# EAGLE design programming_board (EAGLE 6.5.0)
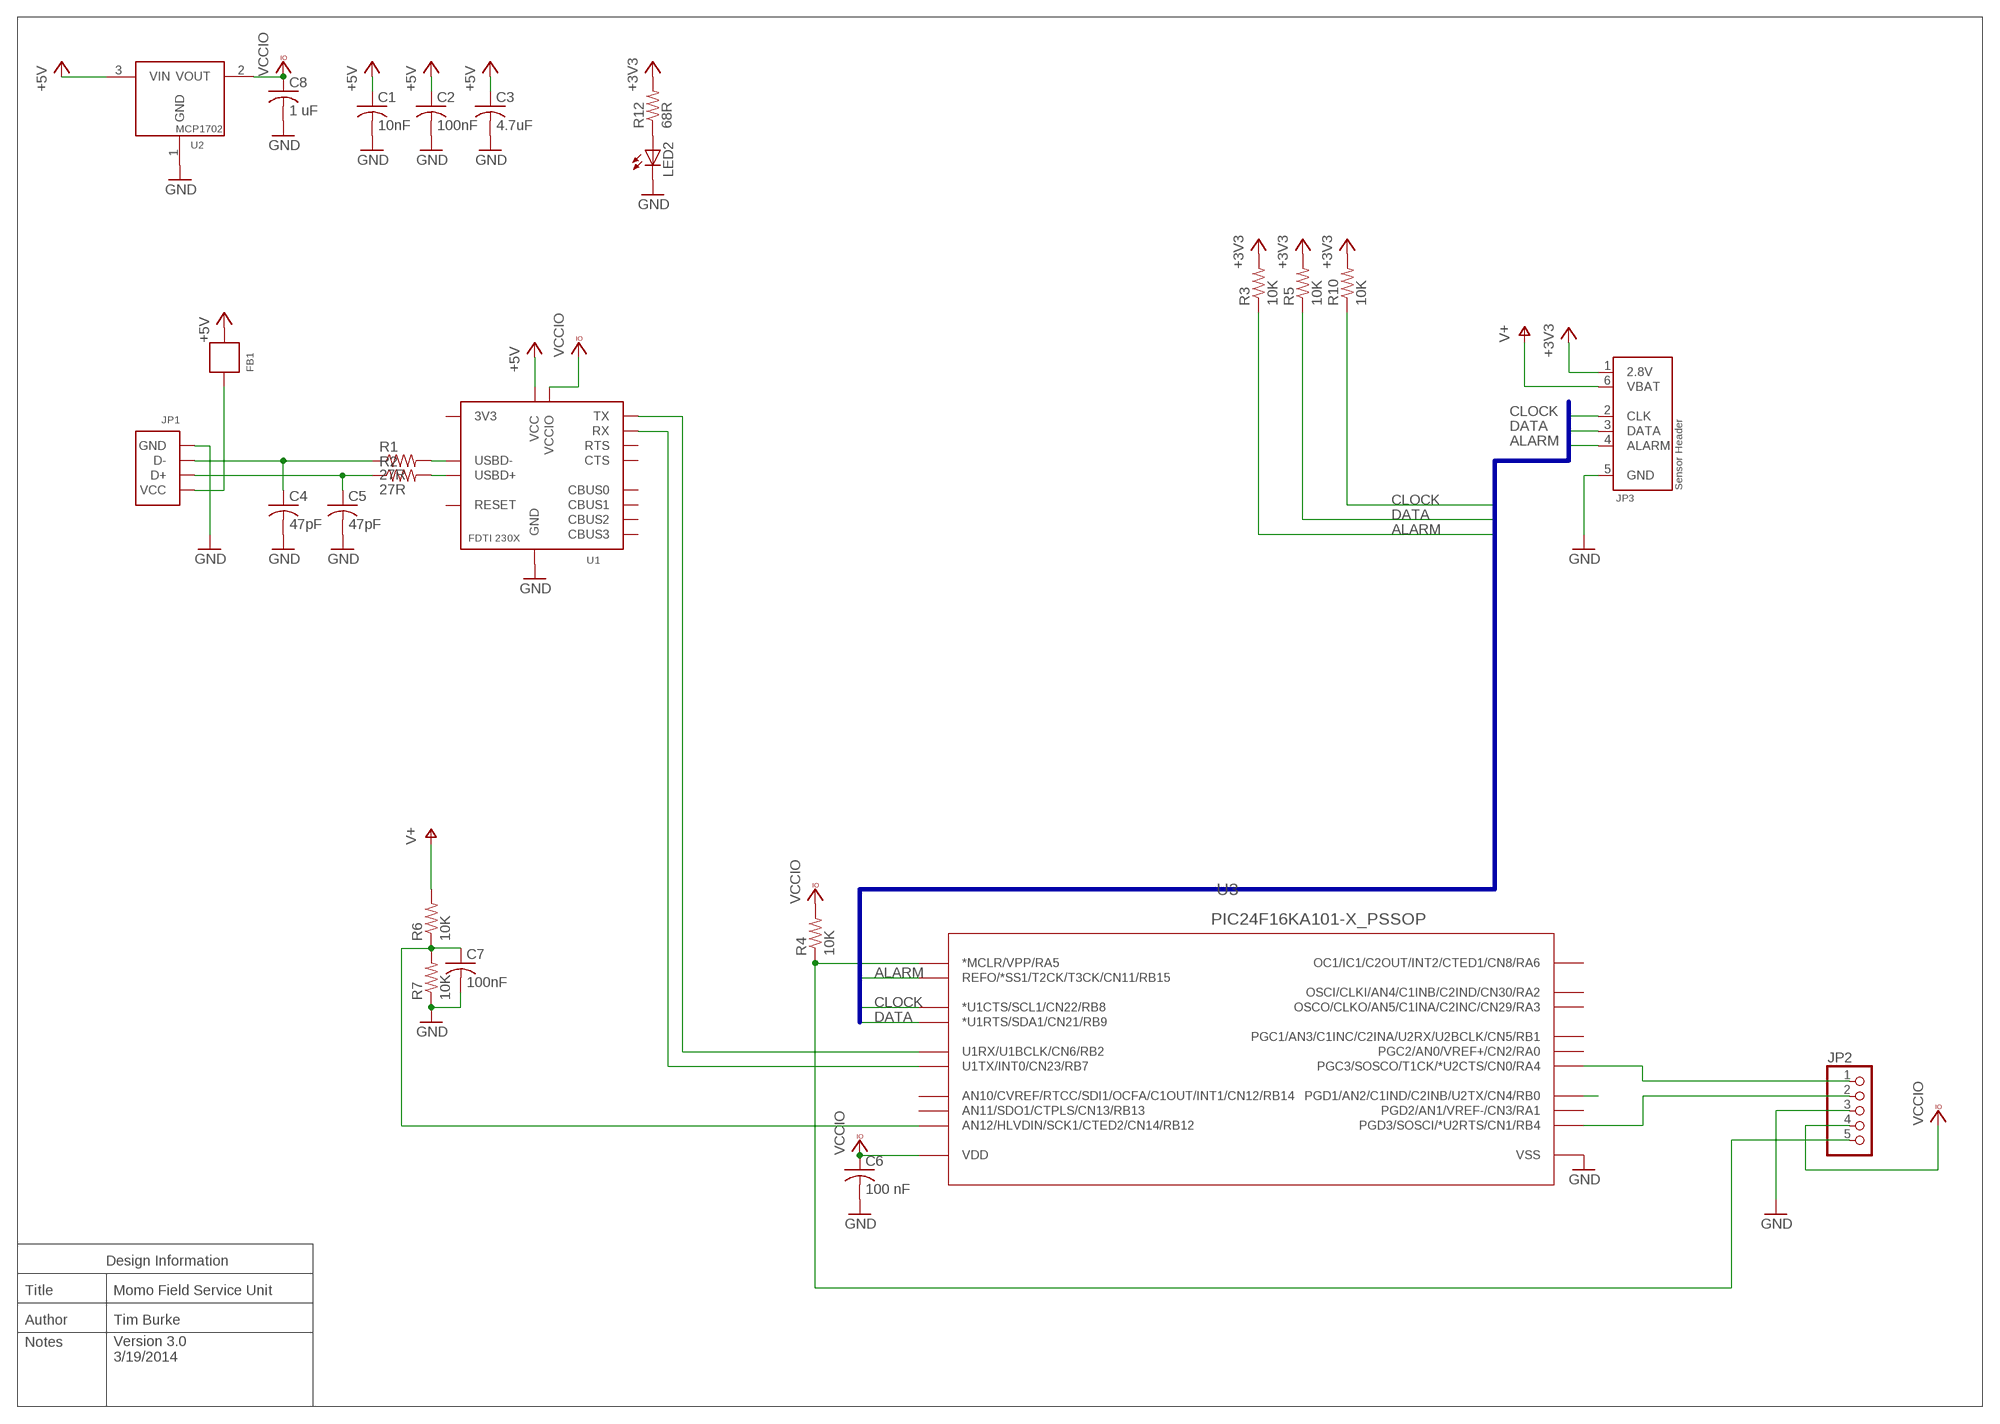
[diagram p0: schematic, sheet 1]

## Parts
C1  10nF  C-USC0402  [C0402]
C2  100nF  C-USC0402  [C0402]
C3  4.7uF  C-USC0805  [C0805]
C4  47pF  C-USC0402  [C0402]
C5  47pF  C-USC0402  [C0402]
C6  100 nF  C-USC0402  [C0402]
C7  100nF  C-USC0402  [C0402]
C8  1 uF  C-USC0402  [C0402]
FB1  FERRITE  [R0805]
JP1  MOLEX-USB-CONN  [USB-MALE-EDGE]
JP2  PINHD-1X5  [1X05]
JP3  MOMO-SENSOR-RJ11-VERT  [RJ12-VERT]
LED2  LEDSML0603  [SML0603]
R1  27R  R-US_R0603  [R0603]
R2  27R  R-US_R0603  [R0603]
R3  10K  R-US_R0603  [R0603]
R4  10K  R-US_R0603  [R0603]
R5  10K  R-US_R0603  [R0603]
R6  10K  R-US_R0603  [R0603]
R7  10K  R-US_R0603  [R0603]
R10  10K  R-US_R0603  [R0603]
R12  68R  R-US_R0603  [R0603]
U1  FTDI-230X  [SSOP16]
U2  MCP1702  [SOT23]
U3  PIC24F16KA101-X_PSSOP  [SSOP20]

## Nets
+3V3: JP3.1(2.8V) R3.2 R5.2 R10.2 R12.2
+5V: C1.1 C2.1 C3.1 FB1.2(OUT) U1.12(VCC) U2.3(VIN)
ALARM: JP3.4(ALARM) R3.1 U3.18(REFO/*SS1/T2CK/T3CK/CN11/RB15)
CLOCK: JP3.2(CLK) R10.1 U3.12(*U1CTS/SCL1/CN22/RB8)
CLOCKRX: U3.4(PGD1/AN2/C1IND/C2INB/U2TX/CN4/RB0)
DATA: JP3.3(DATA) R5.1 U3.13(*U1RTS/SDA1/CN21/RB9)
GND: C1.2 C2.2 C3.2 C4.2 C5.2 C6.2 C7.2 C8.2 JP1.4(GND) JP2.3 JP3.5(GND) LED2.C R7.1 U1.5(GND) U1.13(GND) U2.1(GND) U3.19(VSS)
N$1: C4.1 JP1.2(D-) R1.1
N$2: FB1.1(IN) JP1.1(VCC)
N$3: C5.1 JP1.3(D+) R2.1
N$4: R1.2 U1.9(USBD-)
N$5: R2.2 U1.8(USBD+)
N$7: LED2.A R12.1
N$8: JP2.1 U3.10(PGC3/SOSCO/T1CK/*U2CTS/CN0/RA4)
N$9: JP2.2 U3.9(PGD3/SOSCI/*U2RTS/CN1/RB4)
N$17: C7.1 R6.1 R7.2 U3.15(AN12/HLVDIN/SCK1/CTED2/CN14/RB12)
N$21: JP2.5 R4.1 U3.1(*MCLR/VPP/RA5)
PICRX1: U1.1(TX) U3.6(U1RX/U1BCLK/CN6/RB2)
PICTX1: U1.4(RX) U3.11(U1TX/INT0/CN23/RB7)
V+: JP3.6(VBAT) R6.2
VCCIO: C6.1 C8.1 JP2.4 R4.2 U1.3(VCCIO) U2.2(VOUT) U3.20(VDD)
Unconnected: U1.2(RTS) U1.6(CTS) U1.7(CBUS2) U1.10(3V3) U1.11(RESET) U1.14(CBUS1) U1.15(CBUS0) U1.16(CBUS3) U3.2(PGC2/AN0/VREF+/CN2/RA0) U3.3(PGD2/AN1/VREF-/CN3/RA1) U3.5(PGC1/AN3/C1INC/C2INA/U2RX/U2BCLK/CN5/RB1) U3.7(OSCI/CLKI/AN4/C1INB/C2IND/CN30/RA2) U3.8(OSCO/CLKO/AN5/C1INA/C2INC/CN29/RA3) U3.14(OC1/IC1/C2OUT/INT2/CTED1/CN8/RA6) U3.16(AN11/SDO1/CTPLS/CN13/RB13) U3.17(AN10/CVREF/RTCC/SDI1/OCFA/C1OUT/INT1/CN12/RB14)

## Buses
SIGNALS:DATA,CLOCK,ALARM

## Notes on the sheet
- Design Information
- Title | Momo Field Service Unit
- Author | Tim Burke
- Notes
- Version 3.0
  3/19/2014

## Library data of the parts
C1 = rcl:C-US: CAPACITOR, American symbol; DIGIKEY-PN: 1276-1499-1-ND
C2 C6 C7 = rcl:C-US: CAPACITOR, American symbol; DIGIKEY-PN: 445-1265-1-ND
C3 = rcl:C-US: CAPACITOR, American symbol; DIGIKEY-PN: 445-1605-1-ND
C4 C5 = rcl:C-US: CAPACITOR, American symbol; DIGIKEY-PN: 1276-1699-1-ND
C8 = rcl:C-US: CAPACITOR, American symbol; DIGIKEY-PN: 1276-1076-1-ND
FB1 = components:FERRITE; DESCRIPTION: Ferrite Bead; DIGIKEY-PN: 240-2390-1-ND; FOOTPRINT: SMD 0805
JP1 = components:MOLEX-USB-CONN; DESCRIPTION: USB-A Male Connector PCB Edge Mount; DIGIKEY-PN: WM17118-ND; FOOTPRINT: SMD + Through Hole
JP2 = pinhead:PINHD-1X5: PIN HEADER; POPULATE: NO
JP3 = components:MOMO-SENSOR-RJ11-VERT; DESCRIPTION: Vertical Mount RJ-12 Receptacle; DIGIKEY-PN: AE10391-ND; FOOTPRINT: Through Hole
LED2 = led:LED: LED OSRAM: - CHIPLED LG R971, LG N971, LY N971, LG Q971, LY Q971, LO R971, LY R971 LH N974, LH R974 LS Q976, LO Q976, LY Q976 LO Q996 - Hyper CHIPLED LW Q18S LB Q993, LB Q99A, LB R99A - SideLED LS A670, LO A670, LY A670, LG A670, LP A670 LB A673, LV A673, LT A673, LW A673 LH A674 LY A675 LS A676, LA A676, LO A676, LY A676, LW A676 LS A679, LY A679, LG A679 - Hyper Micro SIDELED® LS Y876, LA Y876, LO Y876, LY Y876 LT Y87S - SmartLED LW L88C, LW L88S LB L89C, LB L89S, LG L890 LS L89K, LO L89K, LY L89K LS L896, LA L896, LO L896, LY L896 - TOPLED LS T670, LO T670, LY T670, LG T670, LP T670 LSG T670, LSP T670, LSY T670, LOP T670, LYG T670 LG T671, LOG T671, LSG T671 LB T673, LV T673, LT T673, LW T673 LH T674 LS T676, LA T676, LO T676, LY T676, LB T676, LH T676, LSB T676, LW T676 LB T67C, LV T67C, LT T67C, LS T67K, LO T67K, LY T67K, LW E67C LS E67B, LA E67B, LO E67B, LY E67B, LB E67C, LV E67C, LT E67C LW T67C LS T679, LY T679, LG T679 LS T770, LO T770, LY T770, LG T770, LP T770 LB T773, LV T773, LT T773, LW T773 LH T774 LS E675, LA E675, LY E675, LS T675 LS T776, LA T776, LO T776, LY T776, LB T776 LHGB T686 LT T68C, LB T68C - Hyper Mini TOPLED® LB M676 - Mini TOPLED Santana® LG M470 LS M47K, LO M47K, LY M47K Source: http://www.osram.convergy.de LUXEON: - LUMILED® LXK2-PW12-R00, LXK2-PW12-S00, LXK2-PW14-U00, LXK2-PW14-V00 LXK2-PM12-R00, LXK2-PM12-S00, LXK2-PM14-U00 LXK2-PE12-Q00, LXK2-PE12-R00, LXK2-PE12-S00, LXK2-PE14-T00, LXK2-PE14-U00 LXK2-PB12-K00, LXK2-PB12-L00, LXK2-PB12-M00, LXK2-PB14-N00, LXK2-PB14-P00, LXK2-PB14-Q00 LXK2-PR12-L00, LXK2-PR12-M00, LXK2-PR14-Q00, LXK2-PR14-R00 LXK2-PD12-Q00, LXK2-PD12-R00, LXK2-PD12-S00 LXK2-PH12-R00, LXK2-PH12-S00 LXK2-PL12-P00, LXK2-PL12-Q00, LXK2-PL12-R00 Source: www.luxeon.com KINGBRIGHT: KA-3528ASYC Source: www.kingbright.com; DESCRIPTION: Green Chip LED; DIGIKEY-PN: 475-1409-1-ND; FOOTPRINT: SMD 0603
R1 R2 = rcl:R-US_: RESISTOR, American symbol; DIGIKEY-PN: P27.0HCT-ND
R3-R7 R10 = rcl:R-US_: RESISTOR, American symbol; DIGIKEY-PN: P10.0KHCT-ND
R12 = rcl:R-US_: RESISTOR, American symbol; DIGIKEY-PN: P68GCT-ND
U1 = components:FTDI-230X; DESCRIPTION: FTDI-230X USB-Serial Adapter IC; DIGIKEY-PN: 768-1135-1-ND; FOOTPRINT: SSOP16
U2 = components:MCP1702; DESCRIPTION: MCP1702 2.8V Linear Regulator; DIGIKEY-PN: MCP1702T-2802E/CBCT-ND
U3 = components:PIC24F16KA101-X_P; DESCRIPTION: PIC 24F16KA101 16-bit Microprocessor; DIGIKEY-PN: PIC24F16KA101-I/SS-ND; FOOTPRINT: SSOP20

## Board
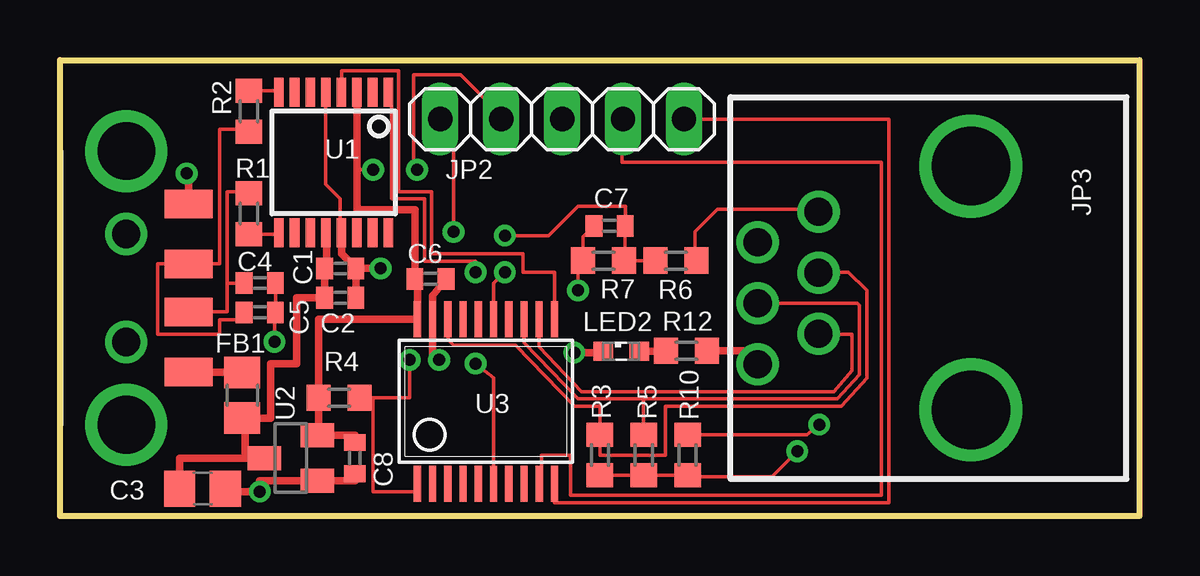
[diagram p1: board, top side]
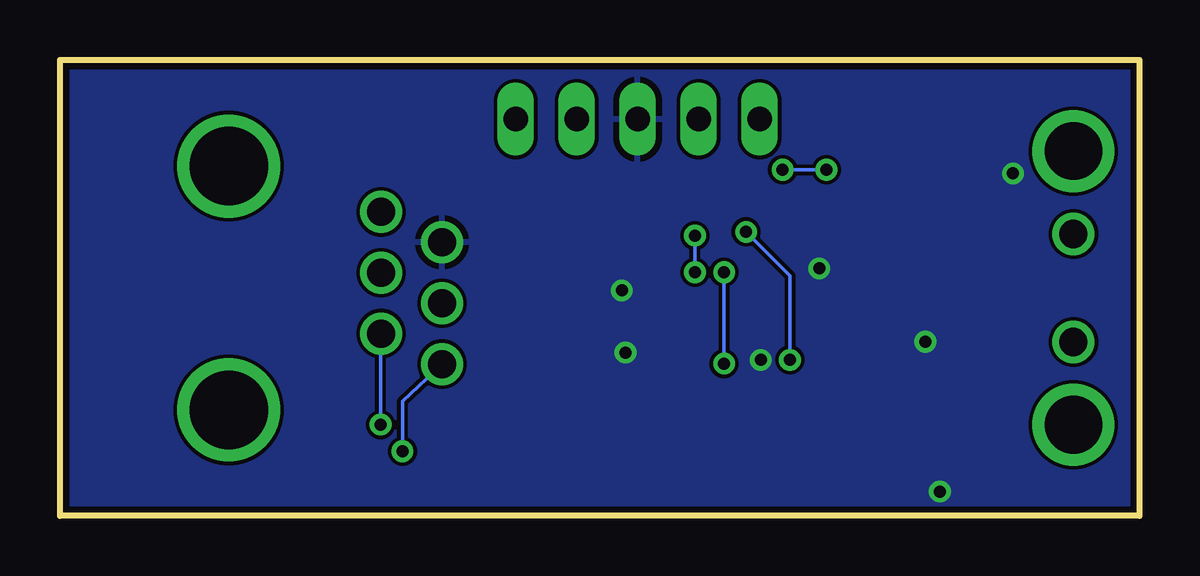
[diagram p2: board, bottom side, seen from below]

Size 45.01 x 19 mm. Coordinates in mm from the lower left corner, seen from the top.
Outline: 0,0 0,19 45.01,19 45.01,0 0,0
Copper layers (1*16): Top 0.035mm / dielectric 1.5mm / Bottom 0.035mm
Design rules "default *": minimum track width 6mil, minimum drill 19mil, track to track 6mil, track to pad 6mil, pad to pad 8mil, via to via 8mil, smd to smd 8mil, copper to edge 10mil, drill to drill 8mil, minimum pad ring 10mil, minimum via ring 8mil, stop-mask expansion 4mil, vias tented up to drill 0mil, thermal gap 10mil

### Footprints (pad centres in the part's own frame; a part is rotated, then mirrored left to right if it is on the bottom)
C0402 = smd 0.7 x 0.9: 1 -0.65,0; 2 0.65,0
C0805 = smd 1.3 x 1.5: 1 -0.95,0; 2 0.95,0
R0805 = smd 1.3 x 1.5: 1 -0.95,0; 2 0.95,0
USB-MALE-EDGE = smd 1.2 x 2: 1 3.5,4.35; 2 1,4.35; 3 -1,4.35; 4 -3.5,4.35 | drill 2.4: P$1 -5.7,1.75; P$2 5.7,1.75 | drill 1.17: P$3 -2.25,1.75; P$4 2.25,1.75
1X05 = drill 1.016 long: 1 -5.08,0; 2 -2.54,0; 3 0,0; 4 2.54,0; 5 5.08,0
RJ12-VERT = drill 1.17: 1 -3.175,8.89; 2 -1.905,6.35; 3 -0.635,8.89; 4 0.635,6.35; 5 1.905,8.89; 6 3.175,6.35 | drill 3.27: ANCHOR1 -5.08,0; ARCHOR2 5.08,0
SML0603 = smd 0.8 x 0.8: A 0.75,0; C -0.75,0
R0603 = smd 1 x 1.1: 1 -0.85,0; 2 0.85,0
SSOP16 = smd 0.4 x 1.2: 1 -2.275,-2.925; 2 -1.625,-2.925; 3 -0.975,-2.925; 4 -0.325,-2.925; 5 0.325,-2.925; 6 0.975,-2.925; 7 1.625,-2.925; 8 2.275,-2.925; 9 2.275,2.925; 10 1.625,2.925; 11 0.975,2.925; 12 0.325,2.925; 13 -0.325,2.925; 14 -0.975,2.925; 15 -1.625,2.925; 16 -2.275,2.925
SOT23 = smd 1 x 1.4: 1 -0.95,-1.1; 2 0.95,-1.1; 3 0,1.1
SSOP20 = smd 0.3 x 1.5: 1 -2.857,-3.431; 2 -2.222,-3.431; 3 -1.587,-3.431; 4 -0.952,-3.431; 5 -0.317,-3.431; 6 0.318,-3.431; 7 0.953,-3.431; 8 1.588,-3.431; 9 2.223,-3.431; 10 2.858,-3.431; 11 2.858,3.431; 12 2.219,3.431; 13 1.588,3.431; 14 0.953,3.431; 15 0.318,3.431; 16 -0.317,3.431; 17 -0.952,3.431; 18 -1.587,3.431; 19 -2.222,3.431; 20 -2.857,3.431

### Placement (x,y rotation side)
C1  11.68,10.31 0 top
C2  11.68,9.09 0 top
C3  5.94,1.14 0 top
C4  8.33,9.7 0 top
C5  8.33,8.48 0 top
C6  15.44,9.88 0 top
C7  22.91,12.09 180 top
C8  12.29,2.41 270 top
FB1  7.59,5.03 270 top
JP1  1.02,9.5 270 top
JP2  20.93,16.54 180 top
JP3  37.97,9.5 90 top
LED2  23.39,6.86 0 top
R1  7.87,12.6 270 top
R2  7.87,16.87 90 top
R3  22.5,2.54 270 top
R4  11.63,4.93 180 top
R5  24.33,2.54 270 top
R6  25.68,10.64 0 top
R7  22.66,10.64 0 top
R10  26.16,2.54 270 top
R12  26.11,6.88 0 top
U1  11.4,14.73 180 top
U2  9.63,2.41 90 top
U3  17.75,4.78 0 top

### Tracks (layer width: path | path; a pad name or v marks a point on that pad's centre or on a via)
+3V3  (via drill 0.5)
  Top 0.152: R3.2 R5.2 R10.2 25.86,1.63 29.67,1.63 v30.73,2.69
  Top 0.305: R12.2 28.52,6.88 JP3.1
  Bottom 0.152: v30.73,2.69 30.73,4.78 JP3.1
+5V
  Top 0.305: U1.12 11.11,11.78 11.11,10.31 C1.1 C2.1 9.86,9.09 9.86,6.35 8.79,6.35 8.79,4.06 7.59,4.06 FB1.2 7.72,3.95 7.72,2.54 7.75,2.41 | 7.75,2.41 U2.3 | C3.1 4.99,2.41 7.75,2.41
ALARM
  Top 0.152: U3.18 16.17,7.35 16.41,7.11 19,7.11 21.44,4.57 22.5,4.57 R3.1 22.5,2.54 25.25,2.54 25.25,4.57 32.56,4.57 33.63,5.74 33.63,9.4 32.87,10.16 31.65,10.16 JP3.4
CLOCK  (via drill 0.5)
  Top 0.152: U3.12 19.97,7.05 21.74,5.18 32.26,5.18 33.02,6.05 33.02,7.57 31.75,7.57 JP3.2 | R10.1 31.13,3.39 v31.65,3.81
  Bottom 0.152: v31.65,3.81 31.65,7.67 JP3.2
DATA
  Top 0.152: 19.3,8.17 U3.13 19.34,7.23 21.59,4.88 24.33,4.88 | R5.1 24.33,4.88 | 24.33,4.88 32.41,4.88 33.32,5.89 33.32,8.79 33.25,8.86 JP3.3
GND  (via drill 0.5)
  Top 0.152: U1.5 11.08,13.81 11.68,13.21 11.68,11.85 U1.13 | C4.2 C5.2 8.94,8.34 v8.94,7.26 | C7.2 21.81,11.64 R7.1 21.59,10.43 v21.59,9.4
  Top 0.305: C1.2 v13.36,10.31 | C3.2 6.89,1.02 v8.33,1.02 8.33,1.46 U2.1 12.29,1.46 C8.2 | C2.2 C1.2 | C1.2 11.73,10.92 U1.13 | JP1.4 5.37,14.27 v5.28,14.27 | C6.2 15.53,9.17 U3.19 15.53,6.77 v15.8,6.5 | LED2.C 22.44,6.81 v21.44,6.81
  pour Bottom: -0.05,19 45.06,19 45.06,-0.05 -0.05,-0.05
N$1
  Top 0.152: JP1.2 6.96,8.5 6.96,9.7 | 6.96,9.7 6.96,13.51 7.72,13.51 R1.1 | C4.1 6.96,9.7
N$2
  Top 0.305: JP1.1 5.39,5.98 FB1.1
N$3
  Top 0.152: R2.1 7.72,16.1 6.65,16.1 6.65,10.5 JP1.3 4.06,10.5 4.06,7.57 6.65,7.57 6.65,8.18 7.66,8.18 C5.1
N$4
  Top 0.152: R1.2 9.13,11.75 U1.9
N$5
  Top 0.152: R2.2 9.13,17.72 U1.8
N$7
  Top 0.305: R12.1 25.24,6.86 LED2.A
N$8
  Top 0.152: JP2.1 34.54,16.54 34.54,0.56 20.61,0.56 U3.10
N$9
  Top 0.152: U3.9 20.07,1.43 20.07,2.54 21.29,2.54 21.29,0.86 34.24,0.86 34.24,14.73 23.42,14.73 23.42,16.54 JP2.2
N$17  (via drill 0.5)
  Top 0.152: U3.15 18.07,9.69 v18.54,10.16 | R6.1 R7.2 23.56,10.7 C7.1 23.57,12.9 21.59,12.9 20.37,11.68 v18.54,11.68
  Bottom 0.152: v18.54,10.16 v18.54,11.68
N$21  (via drill 0.5)
  Top 0.152: U3.1 14.9,1.02 13.06,1.02 13.06,4.93 R4.1 14.58,4.93 v14.58,6.5 | v16.41,11.84 16.41,16.54 JP2.5
  Bottom 0.152: v16.41,11.84 14.58,10.01 v14.58,6.5
PICRX1  (via drill 0.5)
  Top 0.152: U1.1 13.82,17.37 13.82,13.21 15.19,13.21 15.19,10.62 17.32,10.62 v17.32,10.16 | U3.6 18.07,5.75 v17.32,6.35
  Bottom 0.152: v17.32,10.16 v17.32,6.35
PICTX1
  Top 0.152: U1.4 11.73,18.54 14.12,18.54 14.12,13.51 15.49,13.51 15.49,10.92 19.3,10.92 19.3,10.16 20.61,10.16 U3.11
V+
  Top 0.152: R6.2 26.47,10.71 26.47,11.84 27.41,12.78 31.62,12.78 JP3.6
VCCIO  (via drill 0.5)
  Top 0.152: v14.88,14.43 14.73,14.43 14.73,18.39 16.69,18.39 18.39,16.69 JP2.4 | v13.06,14.43 12.38,14.43
  Top 0.305: C8.1 12.29,3.36 U2.2 10.78,3.36 R4.2 10.78,8.21 U3.20 | 14.88,8.21 U3.20 | U3.20 14.9,9.88 C6.1 14.79,12.75 12.38,12.75 12.38,14.43 U1.3
  Bottom 0.152: v14.88,14.43 v13.06,14.43